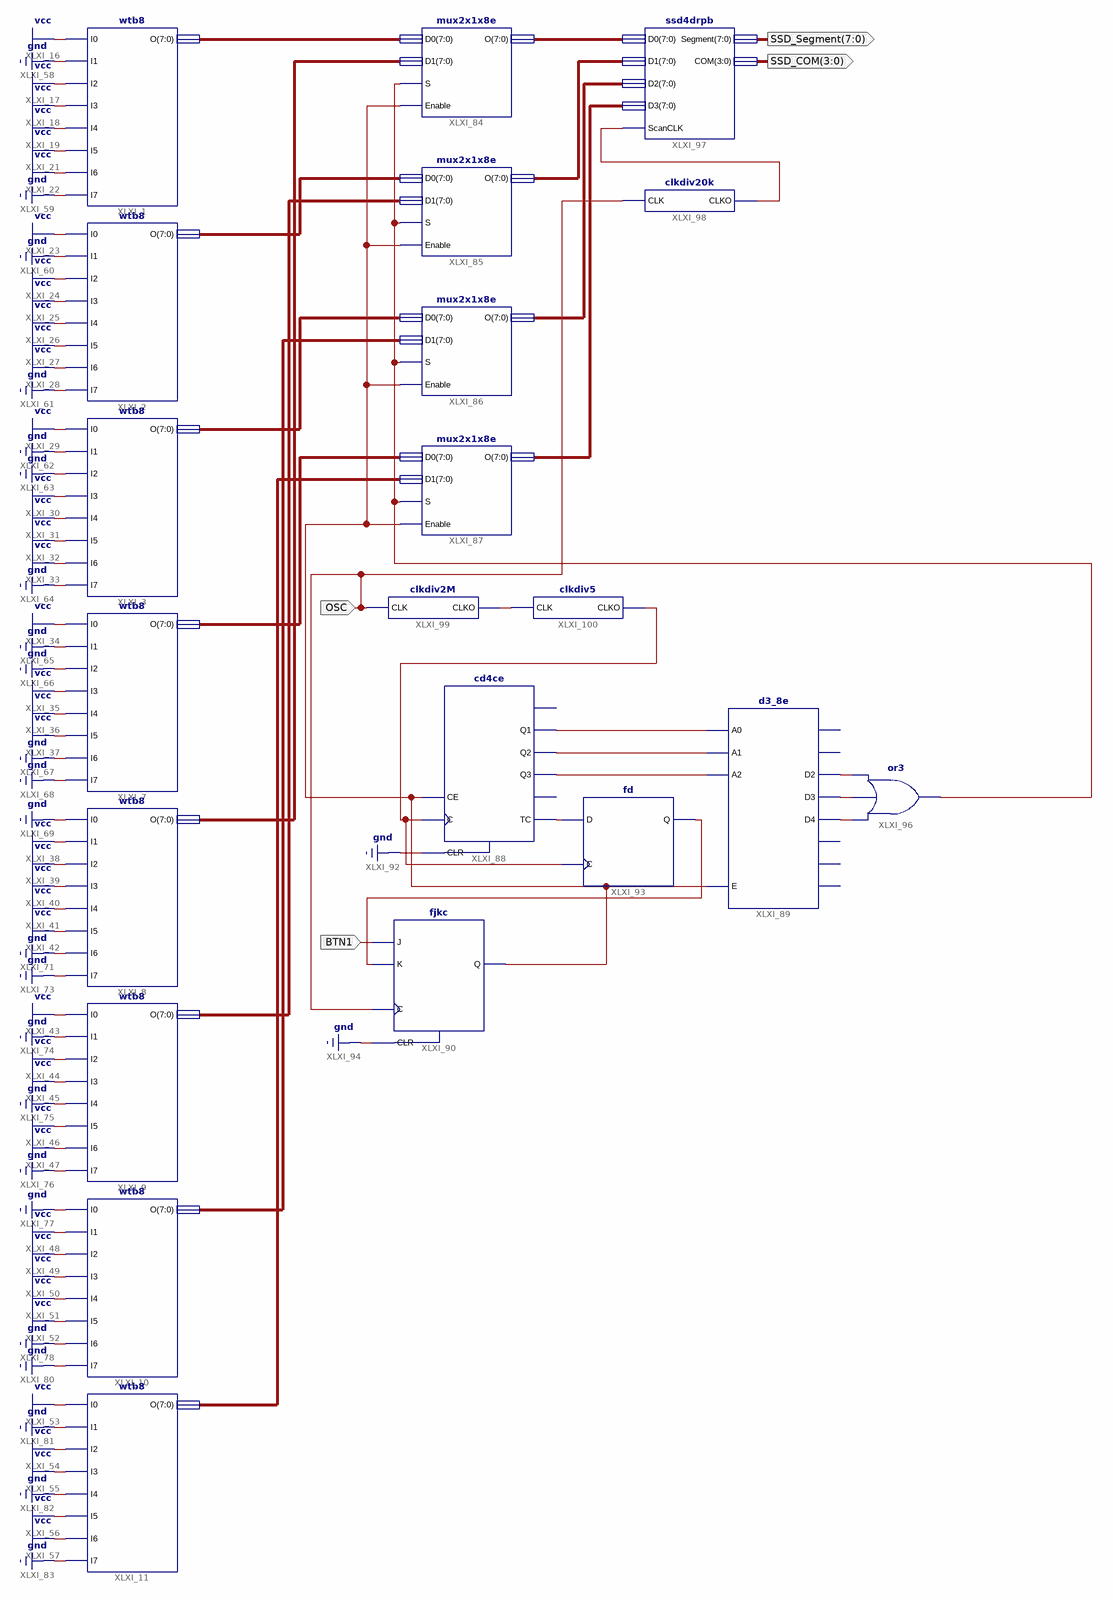
[diagram p0: schematic sheet 1]
// Xilinx ISE schematic main.sch (spartan6) as structural Verilog: 21 symbols, 4 ports
module main (
  input  BTN1,
  input  OSC,
  output [3:0] SSD_COM,
  output [7:0] SSD_Segment
);

  wire XLXN_73, XLXN_74, XLXN_75, XLXN_79, XLXN_83, XLXN_84, XLXN_95, XLXN_96, XLXN_99, XLXN_100, XLXN_101,
       XLXN_106, XLXN_109;
  wire [7:0] XLXN_65, XLXN_66, XLXN_67, XLXN_68, XLXN_69, XLXN_70, XLXN_71, XLXN_72, XLXN_102, XLXN_103,
       XLXN_104, XLXN_105;

  wtb8 XLXI_1 (.I0(1'b1), .I1(1'b0), .I2(1'b1), .I3(1'b1), .I4(1'b1), .I5(1'b1), .I6(1'b1), .I7(1'b0), .O(XLXN_65));
  wtb8 XLXI_2 (.I0(1'b1), .I1(1'b0), .I2(1'b1), .I3(1'b1), .I4(1'b1), .I5(1'b1), .I6(1'b1), .I7(1'b0), .O(XLXN_66));
  wtb8 XLXI_3 (.I0(1'b1), .I1(1'b0), .I2(1'b0), .I3(1'b1), .I4(1'b1), .I5(1'b1), .I6(1'b1), .I7(1'b0), .O(XLXN_67));
  wtb8 XLXI_7 (.I0(1'b1), .I1(1'b0), .I2(1'b0), .I3(1'b1), .I4(1'b1), .I5(1'b1), .I6(1'b0), .I7(1'b0), .O(XLXN_68));
  wtb8 XLXI_9 (.I0(1'b1), .I1(1'b0), .I2(1'b1), .I3(1'b1), .I4(1'b0), .I5(1'b1), .I6(1'b1), .I7(1'b0), .O(XLXN_70));
  wtb8 XLXI_10 (.I0(1'b0), .I1(1'b1), .I2(1'b1), .I3(1'b1), .I4(1'b1), .I5(1'b1), .I6(1'b0), .I7(1'b0), .O(XLXN_71));
  wtb8 XLXI_11 (.I0(1'b1), .I1(1'b0), .I2(1'b1), .I3(1'b1), .I4(1'b0), .I5(1'b1), .I6(1'b1), .I7(1'b0), .O(XLXN_72));
  wtb8 XLXI_8 (.I0(1'b0), .I1(1'b1), .I2(1'b1), .I3(1'b1), .I4(1'b1), .I5(1'b1), .I6(1'b0), .I7(1'b0), .O(XLXN_69));
  mux2x1x8e XLXI_84 (.D0(XLXN_65), .D1(XLXN_69), .Enable(XLXN_95), .O(XLXN_102), .S(XLXN_96));
  mux2x1x8e XLXI_85 (.D0(XLXN_66), .D1(XLXN_70), .Enable(XLXN_95), .O(XLXN_103), .S(XLXN_96));
  mux2x1x8e XLXI_86 (.D0(XLXN_67), .D1(XLXN_71), .Enable(XLXN_95), .O(XLXN_104), .S(XLXN_96));
  mux2x1x8e XLXI_87 (.D0(XLXN_68), .D1(XLXN_72), .Enable(XLXN_95), .O(XLXN_105), .S(XLXN_96));
  cd4ce XLXI_88 (
    .C(XLXN_79), .CE(XLXN_95), .CLR(1'b0), .Q1(XLXN_73), .Q2(XLXN_74), .Q3(XLXN_75), .TC(XLXN_84));  // open: CEO, Q0
  d3_8e XLXI_89 (
    .A0(XLXN_73), .A1(XLXN_74), .A2(XLXN_75), .E(XLXN_95), .D2(XLXN_101), .D3(XLXN_100), .D4(XLXN_99));  // open: D0, D1, D5, D6, D7
  fjkc XLXI_90 (.C(OSC), .CLR(1'b0), .J(BTN1), .K(XLXN_83), .Q(XLXN_95));
  fd XLXI_93 (.C(XLXN_79), .D(XLXN_84), .Q(XLXN_83));
  or XLXI_96 (XLXN_96, XLXN_99, XLXN_100, XLXN_101);
  ssd4drpb XLXI_97 (
    .COM(SSD_COM), .D0(XLXN_102), .D1(XLXN_103), .D2(XLXN_104), .D3(XLXN_105), .ScanCLK(XLXN_106),
    .Segment(SSD_Segment));
  clkdiv20k XLXI_98 (.CLK(OSC), .CLKO(XLXN_106));
  clkdiv2M XLXI_99 (.CLK(OSC), .CLKO(XLXN_109));
  clkdiv5 XLXI_100 (.CLK(XLXN_109), .CLKO(XLXN_79));
endmodule
